# EAGLE design USB_POWERED_v2 (EAGLE 8.2.2)
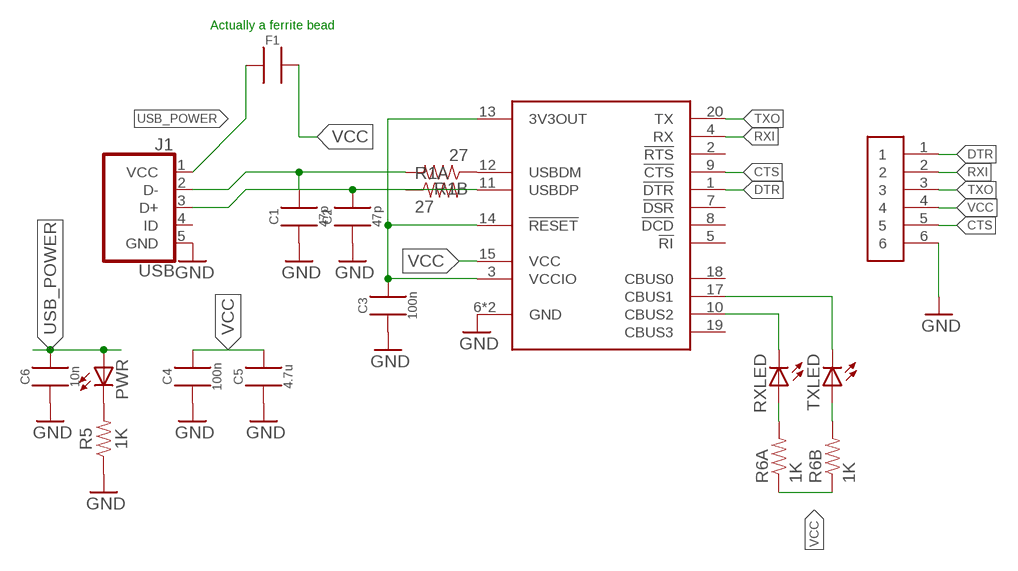
[diagram p0: schematic, sheet 1]

## Parts
C1  47p  CAP0603A  [0603_A]
C2  47p  CAP0603A  [0603_A]
C3  100n  CAP0603A  [0603_A]
C4  100n  CAP0603A  [0603_A]
C5  4.7u  CAP0603A  [0603_A]
C6  10n  CAP0603A  [0603_A]
F1  CAP0603A  [0603_A]
J1  USB  [629105136821]
PWR  LEDCHIP-LED0805  [CHIP-LED0805]
R1  27  RESISTOR_ARRAY_4CTS_742  [RESISTOR_ARRAY_CTS_742_4]
R5  1K  RESISTOR0603  [0603]
R6  1K  RESISTOR_ARRAY_2  [RESISTOR_ARRAY_CTS_742C043]
RXLED  LEDCHIP-LED0805  [CHIP-LED0805]
TXLED  LEDCHIP-LED0805  [CHIP-LED0805]
U$1  FT231XSSOP  [SSOP-20]
U$2  M06  [M20_6_PIN]

## Nets
3V3OUT: C3.2 U$1.3(VCCIO) U$1.13(3V3OUT) U$1.14(!RESET)
CTS: U$1.9(!CTS) U$2.5
DTR: U$1.1(!DTR) U$2.1
GND: C1.1 C2.1 C3.1 C4.1 C5.1 C6.1 J1.5(GND) R5.1 U$1.6(GND) U$1.16(GND) U$2.6
N$1: R1.P$3 U$1.12(USBDM)
N$2: R1.P$1 U$1.11(USBDP)
N$3: PWR.C R5.2
N$4: C1.2 J1.2(D-) R1.P$4
N$5: C2.2 J1.3(D+) R1.P$2
N$6: R6.P$6 TXLED.A
N$7: R6.P$4 RXLED.A
N$8: RXLED.C U$1.10(CBUS2)
N$9: TXLED.C U$1.17(CBUS1)
RXI: U$1.4(RX) U$2.2
TXO: U$1.20(TX) U$2.3
USB_POWER: C6.2 F1.1 J1.1(VCC) PWR.A
VCC: C4.2 C5.2 F1.2 R6.P$3 R6.P$5 U$1.15(VCC) U$2.4
Unconnected: J1.4(ID) R1.P$5 R1.P$6 R1.P$7 R1.P$8 U$1.2(!RTS) U$1.5(!RI) U$1.7(!DSR) U$1.8(!DCD) U$1.18(CBUS0) U$1.19(CBUS3)

## Notes on the sheet
- Actually a ferrite bead

## Library data of the parts
C1-C6 F1 = KEMET:CAP
J1 = Wurth:USB
PWR RXLED TXLED = led:LED: LED OSRAM: - CHIPLED LG R971, LG N971, LY N971, LG Q971, LY Q971, LO R971, LY R971 LH N974, LH R974 LS Q976, LO Q976, LY Q976 LO Q996 - Hyper CHIPLED LW Q18S LB Q993, LB Q99A, LB R99A - SideLED LS A670, LO A670, LY A670, LG A670, LP A670 LB A673, LV A673, LT A673, LW A673 LH A674 LY A675 LS A676, LA A676, LO A676, LY A676, LW A676 LS A679, LY A679, LG A679 - Hyper Micro SIDELED® LS Y876, LA Y876, LO Y876, LY Y876 LT Y87S - SmartLED LW L88C, LW L88S LB L89C, LB L89S, LG L890 LS L89K, LO L89K, LY L89K LS L896, LA L896, LO L896, LY L896 - TOPLED LS T670, LO T670, LY T670, LG T670, LP T670 LSG T670, LSP T670, LSY T670, LOP T670, LYG T670 LG T671, LOG T671, LSG T671 LB T673, LV T673, LT T673, LW T673 LH T674 LS T676, LA T676, LO T676, LY T676, LB T676, LH T676, LSB T676, LW T676 LB T67C, LV T67C, LT T67C, LS T67K, LO T67K, LY T67K, LW E67C LS E67B, LA E67B, LO E67B, LY E67B, LB E67C, LV E67C, LT E67C LW T67C LS T679, LY T679, LG T679 LS T770, LO T770, LY T770, LG T770, LP T770 LB T773, LV T773, LT T773, LW T773 LH T774 LS E675, LA E675, LY E675, LS T675 LS T776, LA T776, LO T776, LY T776, LB T776 LHGB T686 LT T68C, LB T68C - Hyper Mini TOPLED® LB M676 - Mini TOPLED Santana® LG M470 LS M47K, LO M47K, LY M47K Source: http://www.osram.convergy.de LUXEON: - LUMILED® LXK2-PW12-R00, LXK2-PW12-S00, LXK2-PW14-U00, LXK2-PW14-V00 LXK2-PM12-R00, LXK2-PM12-S00, LXK2-PM14-U00 LXK2-PE12-Q00, LXK2-PE12-R00, LXK2-PE12-S00, LXK2-PE14-T00, LXK2-PE14-U00 LXK2-PB12-K00, LXK2-PB12-L00, LXK2-PB12-M00, LXK2-PB14-N00, LXK2-PB14-P00, LXK2-PB14-Q00 LXK2-PR12-L00, LXK2-PR12-M00, LXK2-PR14-Q00, LXK2-PR14-R00 LXK2-PD12-Q00, LXK2-PD12-R00, LXK2-PD12-S00 LXK2-PH12-R00, LXK2-PH12-S00 LXK2-PL12-P00, LXK2-PL12-Q00, LXK2-PL12-R00 Source: www.luxeon.com KINGBRIGHT: KA-3528ASYC Source: www.kingbright.com
R1 = ERIC:RESISTOR_ARRAY_4: Resistor Array with 4 isolated resistors
R5 = Stackpole:RESISTOR
R6 = ERIC:RESISTOR_ARRAY_2
U$1 = FTDI:FT231X
U$2 = HARWIN:M06

## Board
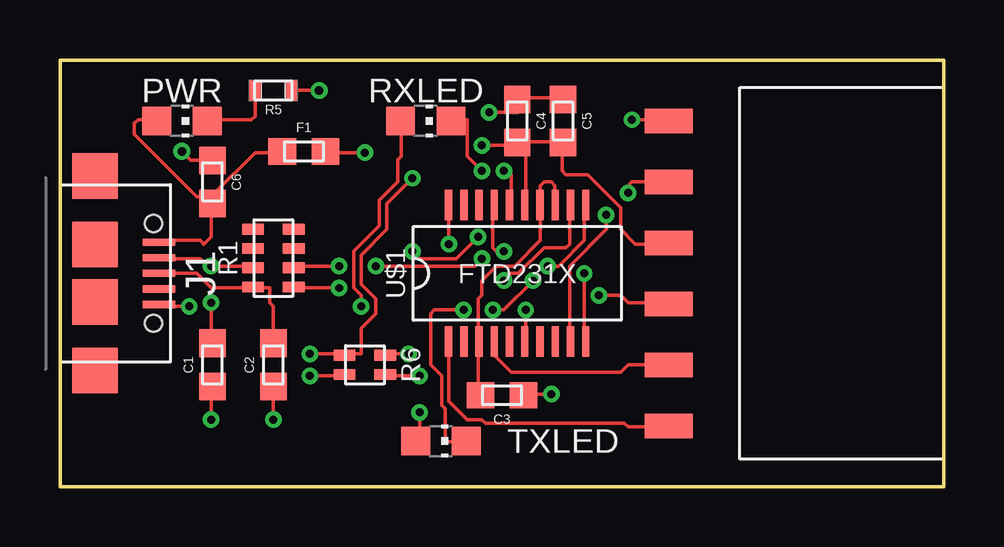
[diagram p1: board, top side]
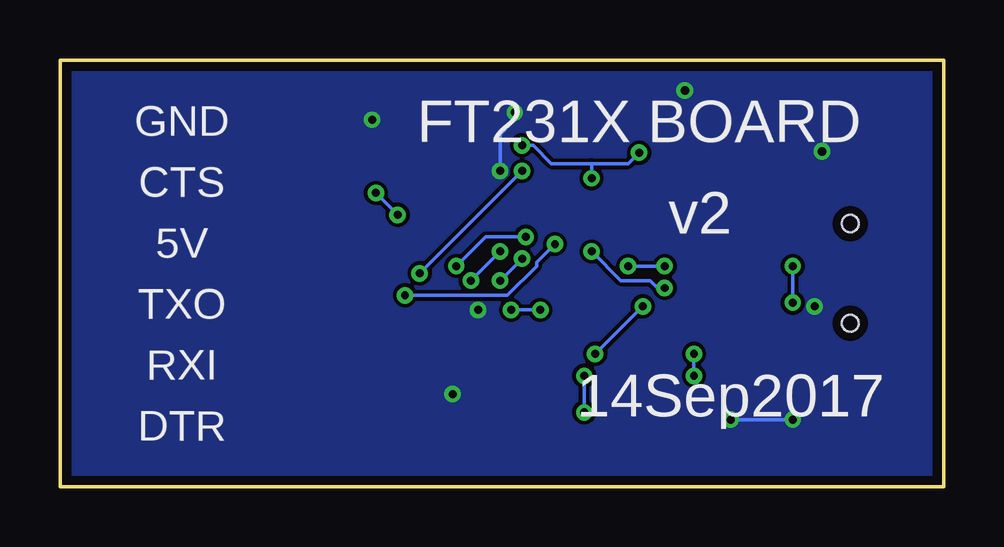
[diagram p2: board, bottom side, seen from below]

Size 36.83 x 17.78 mm. Coordinates in mm from the lower left corner, seen from the top.
Outline: 0,17.78 36.83,17.78 36.83,0 0,0 0,17.78
Copper layers (1*16): Top 0.0356mm / dielectric 1.5011mm / Bottom 0.0356mm
Design rules "oshpark-2layer-2": minimum track width 6mil, minimum drill 13mil, track to track 6mil, track to pad 6mil, pad to pad 6mil, via to via 6mil, smd to smd 6mil, copper to edge 15mil, drill to drill 6mil, minimum pad ring 7mil, minimum via ring 7mil, stop-mask expansion 2.5mil, vias tented up to drill 0mil, thermal gap 10mil

### Footprints (pad centres in the part's own frame; a part is rotated, then mirrored left to right if it is on the bottom)
0603_A = smd 1.15 x 1.1: 1 -0.9,0; 2 0.9,0
629105136821 = smd 0.3 x 1.35: 1 -1.3,4.125; 2 -0.65,4.125; 3 0,4.125; 4 0.65,4.125; 5 1.3,4.125 | smd 1.9 x 1.9: P$6 1.2,1.45; P$7 -1.2,1.45; P$8 4.05,1.45; P$9 -4.05,1.45 | hole 0.7: -2.075,3.9; 2.075,3.9
CHIP-LED0805 = smd 1.2 x 1.2: A 0,-1.05; C 0,1.05
RESISTOR_ARRAY_CTS_742_4 = smd 0.45 x 0.9: P$1 -1.2,-0.85; P$2 -1.2,0.85; P$3 -0.4,-0.85; P$4 -0.4,0.85; P$5 0.4,-0.85; P$6 0.4,0.85; P$7 1.2,-0.85; P$8 1.2,0.85
0603 = smd 0.5 x 0.9: 1 -0.75,0; 2 0.75,0
RESISTOR_ARRAY_CTS_742C043 = smd 0.45 x 0.9: P$3 -0.4,-0.85; P$4 -0.4,0.85; P$5 0.4,-0.85; P$6 0.4,0.85
SSOP-20 = smd 0.305 x 1.27: 1 -2.857,-2.84; 2 -2.223,-2.84; 3 -1.587,-2.84; 4 -0.953,-2.84; 5 -0.318,-2.84; 6 0.318,-2.84; 7 0.953,-2.84; 8 1.587,-2.84; 9 2.223,-2.84; 10 2.857,-2.84; 11 2.857,2.84; 12 2.223,2.84; 13 1.587,2.84; 14 0.953,2.84; 15 0.318,2.84; 16 -0.318,2.84; 17 -0.953,2.84; 18 -1.587,2.84; 19 -2.223,2.84; 20 -2.857,2.84
M20_6_PIN = smd 1.02 x 2: 1 -6.35,11.475; 2 -3.81,11.475; 3 -1.27,11.475; 4 1.27,11.475; 5 3.81,11.475; 6 6.35,11.475

### Placement (x,y rotation side)
C1  6.35,5.08 90 top
C2  8.89,5.08 90 top
C3  18.41,3.81 180 top
C4  19.05,15.24 270 top
C5  20.95,15.24 270 top
C6  6.35,12.7 270 top
F1  10.16,13.97 0 top
J1  0,8.89 270 top
PWR  5.08,15.24 270 top
R1  8.89,9.53 90 top
R5  8.89,16.51 180 top
R6  12.7,5.08 270 top
RXLED  15.24,15.24 270 top
TXLED  15.88,1.91 270 top
U$1  19.05,8.89 0 top
U$2  36.83,8.89 90 top

### Tracks (layer width: path | path; a pad name or v marks a point on that pad's centre or on a via)
3V3OUT
  Top 0.152: U$1.13 20.62,11.79 20.62,12.55 20.47,12.7 20.17,12.7 20.02,12.55 20.02,11.79 U$1.14 20.02,11.63 20.02,10.26 18.95,9.2 18.19,9.2 17.58,8.59 17.58,7.98 17.42,7.82 17.42,6.15 U$1.3 17.42,5.99 17.42,4.32 17.58,4.17 17.58,3.86 C3.2
CTS  (via drill 0.33)
  Top 0.152: v22.76,11.33 22.76,10.72 21.23,9.2 21.23,6.15 U$1.9 | v23.67,12.24 23.67,12.55 23.82,12.7 U$2.5
  Bottom 0.152: v23.67,12.24 v22.76,11.33
DTR
  Top 0.152: U$1.1 16.2,5.99 16.2,3.56 16.97,2.79 17.58,2.79 17.73,2.64 23.52,2.64 23.67,2.49 25.35,2.49 U$2.1
GND  (via drill 0.33, 0.35)
  Top 0.152: v6.3,2.79 6.3,4.17 C1.1 | C2.1 v8.89,2.79 | v17.88,15.6 19.1,15.6 19.1,16.05 C4.1 19.1,16.2 20.93,16.2 C5.1 | v18.49,13.16 18.64,13.16 18.8,13.01 18.8,11.79 U$1.16 | v23.82,15.29 25.35,15.29 U$2.6 | v5.38,7.52 4.32,7.52 4.17,7.67 J1.5 | v10.79,16.51 R5.1 | C6.1 5.45,13.6 v5.08,13.97 | v20.47,3.86 19.41,3.86 C3.1 | v19.41,7.37 19.41,6.15 U$1.6
  Bottom 0.152: v8.89,2.79 v6.3,2.79 | v17.88,15.6 17.88,15.29 18.49,14.68 v18.49,13.16
  pour Bottom: -2.54,26.67 41.91,26.67 41.91,-3.81 -2.54,-3.81
N$1  (via drill 0.33)
  Top 0.152: v11.63,9.2 9.8,9.2 R1.P$3 | v13.16,9.2 17.27,9.2 v17.58,9.5 | v18.49,8.59 18.8,8.89 19.1,8.89 20.17,9.96 21.08,9.96 21.23,10.11 21.23,11.63 U$1.12
  Bottom 0.152: v13.16,9.2 v11.63,9.2 | v18.49,8.59 v17.58,9.5
N$2  (via drill 0.33)
  Top 0.152: v11.63,8.28 9.8,8.28 R1.P$1 | v14.68,9.8 14.99,9.5 16.51,9.5 v17.42,10.41 | v20.32,9.2 20.78,9.2 21.84,10.26 21.84,11.63 U$1.11
  Bottom 0.152: v11.63,8.28 11.94,8.28 12.24,8.59 13.46,8.59 v14.68,9.8 | v17.42,10.41 19.1,10.41 v20.32,9.2
N$3
  Top 0.152: R5.2 8.13,16.51 8.13,15.44 7.98,15.29 6.15,15.29 PWR.C
N$4  (via drill 0.33)
  Top 0.152: R1.P$4 7.98,9.2 v6.3,9.2 6.15,9.2 5.84,9.5 4.17,9.5 J1.2 | v6.3,7.67 6.3,5.99 C1.2
  Bottom 0.152: v6.3,9.2 v6.3,7.67
N$5
  Top 0.152: C2.2 8.89,7.52 8.74,7.67 8.74,8.28 8.13,8.28 R1.P$2 7.98,8.28 6.3,8.28 5.69,8.89 J1.3
N$6  (via drill 0.33)
  Top 0.152: v14.99,4.62 13.61,4.62 R6.P$6 | v14.99,3.1 14.99,1.88 14.83,1.88 TXLED.A
  Bottom 0.152: v14.99,3.1 v14.99,4.62
N$7  (via drill 0.33)
  Top 0.152: v14.53,5.54 13.61,5.54 R6.P$4 | v12.55,7.52 12.55,7.98 12.24,8.28 12.24,9.8 13.31,10.87 13.31,11.94 14.07,12.7 14.07,13.61 14.22,13.77 14.22,15.14 RXLED.A
  Bottom 0.152: v12.55,7.52 v14.53,5.54
N$8  (via drill 0.33)
  Top 0.152: v17.58,13.16 16.97,13.77 16.97,15.29 16.36,15.29 RXLED.C | v21.84,8.89 21.84,6.15 U$1.10
  Bottom 0.152: v21.84,8.89 v17.58,13.16
N$9  (via drill 0.33)
  Top 0.152: v16.81,7.37 15.6,7.37 15.44,7.21 15.44,5.08 15.9,4.62 15.9,3.4 16.05,3.25 16.05,1.88 16.81,1.88 TXLED.C | v18.03,7.37 18.49,7.37 v19.71,8.59 | v18.49,9.8 18.19,9.8 18.03,9.96 18.03,11.63 U$1.17
  Bottom 0.152: v18.03,7.37 v16.81,7.37 | v18.49,9.8 v19.71,8.59
RXI
  Top 0.152: U$2.2 23.67,5.08 23.37,4.78 18.8,4.78 18.03,5.54 18.03,5.99 U$1.4
TXO  (via drill 0.33)
  Top 0.152: v16.2,10.11 16.2,11.63 U$1.20 | v22.45,7.98 23.37,7.98 23.67,7.67 25.35,7.67 U$2.3
  Bottom 0.152: v16.2,10.11 16.97,9.35 16.97,9.2 18.19,7.98 v22.45,7.98
USB_POWER
  Top 0.152: C6.2 6.3,11.79 6.3,10.41 5.99,10.11 5.84,10.26 4.32,10.26 4.17,10.11 J1.1 | 6.45,12.24 6.3,12.09 6.3,11.94 C6.2 | 6.45,12.24 8.13,13.92 9.04,13.92 9.2,14.07 F1.1 | 6.45,12.24 6.3,12.24 6.15,12.09 5.69,12.09 3.1,14.68 3.1,15.14 3.25,15.29 4.01,15.29 PWR.A | 6.45,12.24 C6.2
VCC  (via drill 0.33)
  Top 0.152: v10.41,4.62 11.79,4.62 R6.P$5 | v10.41,5.54 11.79,5.54 R6.P$3 11.94,5.54 12.55,5.54 12.55,6.6 13.16,7.21 13.16,7.82 12.55,8.43 12.55,9.65 13.61,10.72 13.61,11.79 v14.68,12.85 | v12.7,13.92 11.18,13.92 F1.2 | v17.58,14.22 18.95,14.22 C4.2 | 19.41,14.38 19.1,14.38 C4.2 | 19.41,14.38 20.93,14.38 C5.2 20.93,14.22 20.93,13.16 21.08,13.01 22,13.01 23.37,11.63 23.37,10.72 23.98,10.11 25.35,10.11 U$2.4 | 19.41,14.38 19.41,11.79 U$1.15 | 19.41,14.38 C4.2
  Bottom 0.152: v10.41,5.54 v10.41,4.62 | v12.7,13.92 13.16,13.46 14.68,13.46 | 14.68,13.46 16.36,13.46 17.12,14.22 v17.58,14.22 | 14.68,13.46 v14.68,12.85

### Text on the board
bPlace: FT231X BOARD | GND | CTS | v2 | 5V | TXO | RXI | 14Sep2017 | DTR